# Altium schematic sheet blueboard_h_bridges.SchDoc
size A4
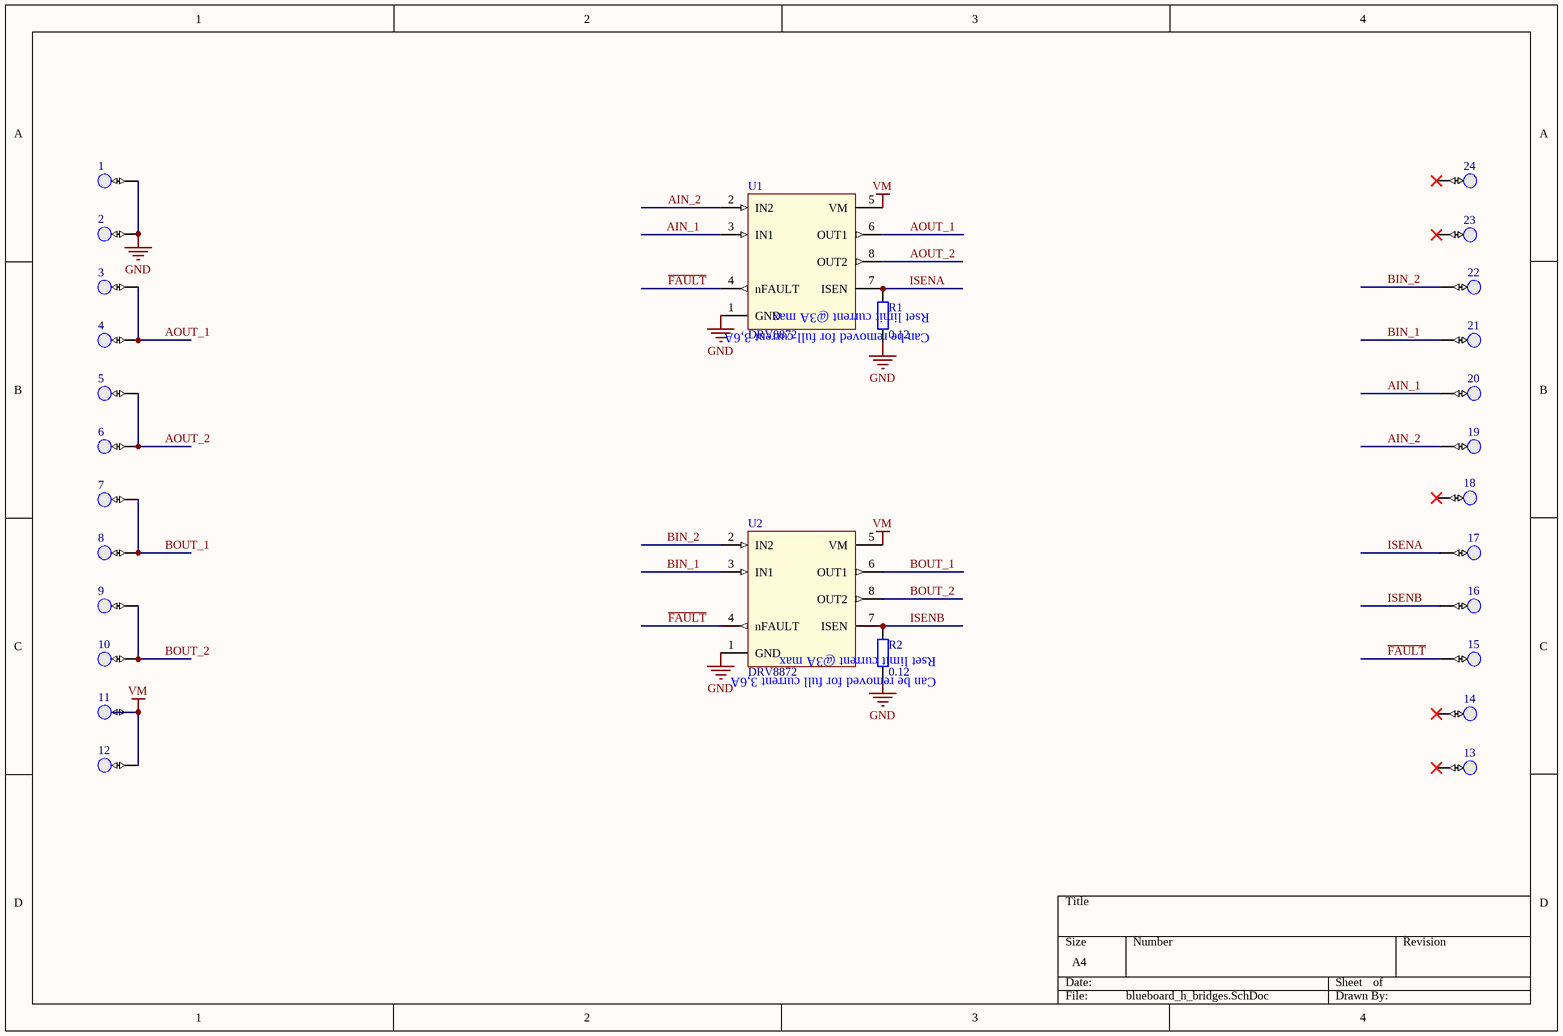
[diagram p0: blueboard_h_bridges.SchDoc]

## Parts
1  Pad  [PAD]  (value not drawn)
2  Pad  [PAD]  (value not drawn)
3  Pad  [PAD]  (value not drawn)
4  Pad  [PAD]  (value not drawn)
5  Pad  [PAD]  (value not drawn)
6  Pad  [PAD]  (value not drawn)
7  Pad  [PAD]  (value not drawn)
8  Pad  [PAD]  (value not drawn)
9  Pad  [PAD]  (value not drawn)
10  Pad  [PAD]  (value not drawn)
11  Pad  [PAD]  (value not drawn)
12  Pad  [PAD]  (value not drawn)
13  Pad  [PAD]  (value not drawn)
14  Pad  [PAD]  (value not drawn)
15  Pad  [PAD]  (value not drawn)
16  Pad  [PAD]  (value not drawn)
17  Pad  [PAD]  (value not drawn)
18  Pad  [PAD]  (value not drawn)
19  Pad  [PAD]  (value not drawn)
20  Pad  [PAD]  (value not drawn)
21  Pad  [PAD]  (value not drawn)
22  Pad  [PAD]  (value not drawn)
23  Pad  [PAD]  (value not drawn)
24  Pad  [PAD]  (value not drawn)
R1  value 0.12  [2512]  (hidden comment: Res2)
R2  value 0.12  [2512]  (hidden comment: Res2)
U1  DRV8872  [DDA]
U2  DRV8872  [DDA]

## Nets
GND: 1.1(Pad) 2.1(Pad) R1.1 R2.1 U1.1(GND) U1.PPAD U2.1(GND) U2.PPAD
VM: 11.1(Pad) 12.1(Pad) U1.5(VM) U2.5(VM)
AIN_1: 20.1(Pad) U1.3(IN1)
AIN_2: 19.1(Pad) U1.2(IN2)
AOUT_1: 3.1(Pad) 4.1(Pad) U1.6(OUT1)
AOUT_2: 5.1(Pad) 6.1(Pad) U1.8(OUT2)
BIN_1: 21.1(Pad) U2.3(IN1)
BIN_2: 22.1(Pad) U2.2(IN2)
BOUT_1: 7.1(Pad) 8.1(Pad) U2.6(OUT1)
BOUT_2: 9.1(Pad) 10.1(Pad) U2.8(OUT2)
~{FAULT}: 15.1(Pad) U1.4(nFAULT) U2.4(nFAULT)
ISENA: 17.1(Pad) R1.2 U1.7(ISEN)
ISENB: 16.1(Pad) R2.2 U2.7(ISEN)

Not connected (* = marked no-connect by the designer): 13 1(Pad)*; 14 1(Pad)*; 18 1(Pad)*; 23 1(Pad)*; 24 1(Pad)*

## Notes on the sheet
- Rset limit current @3A max
- (near R1) Can be removed for full current 3,6A
- Can be removed for full current 3,6A

## Library data of the parts
R1 R2 = Res2: Resistor; Published: 8-Jun-2000; LatestRevisionDate: 17-Jul-2002; LatestRevisionNote: Re-released for DXP Platform.; PackageReference: AXIAL-0.4; Publisher: Altium Limited; Supplier: FARNELL
U1 U2 = DRV8872: 3.6A Brushed  DC Motor  Driver  With Fault Reporting